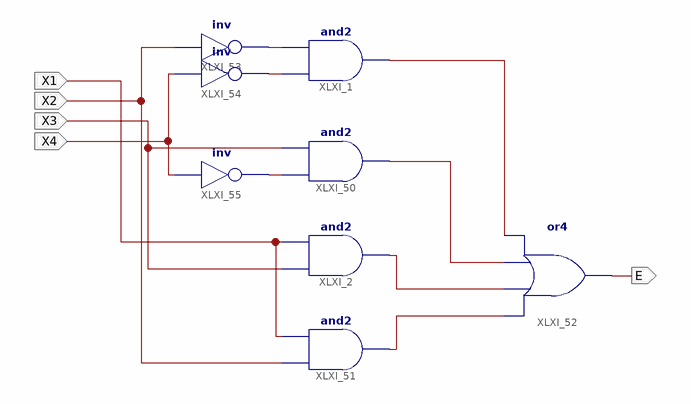
[diagram p0: schematic sheet 1]
// Xilinx ISE schematic bin7seg_e.sch (spartan3e) as structural Verilog: 8 symbols, 5 ports
module bin7seg_e (
  input  X1,
  input  X2,
  input  X3,
  input  X4,
  output E
);

  wire XLXN_1, XLXN_2, XLXN_3, XLXN_9, XLXN_57, XLXN_58, XLXN_59;

  and XLXI_1 (XLXN_1, XLXN_58, XLXN_57);
  and XLXI_50 (XLXN_2, XLXN_59, X3);
  and XLXI_2 (XLXN_3, X3, X1);
  and XLXI_51 (XLXN_9, X2, X1);
  or XLXI_52 (E, XLXN_9, XLXN_3, XLXN_2, XLXN_1);
  not XLXI_53 (XLXN_57, X2);
  not XLXI_54 (XLXN_58, X4);
  not XLXI_55 (XLXN_59, X4);
endmodule
